# Altium schematic sheet Option_Audio.SchDoc
size 297 x 209 mm
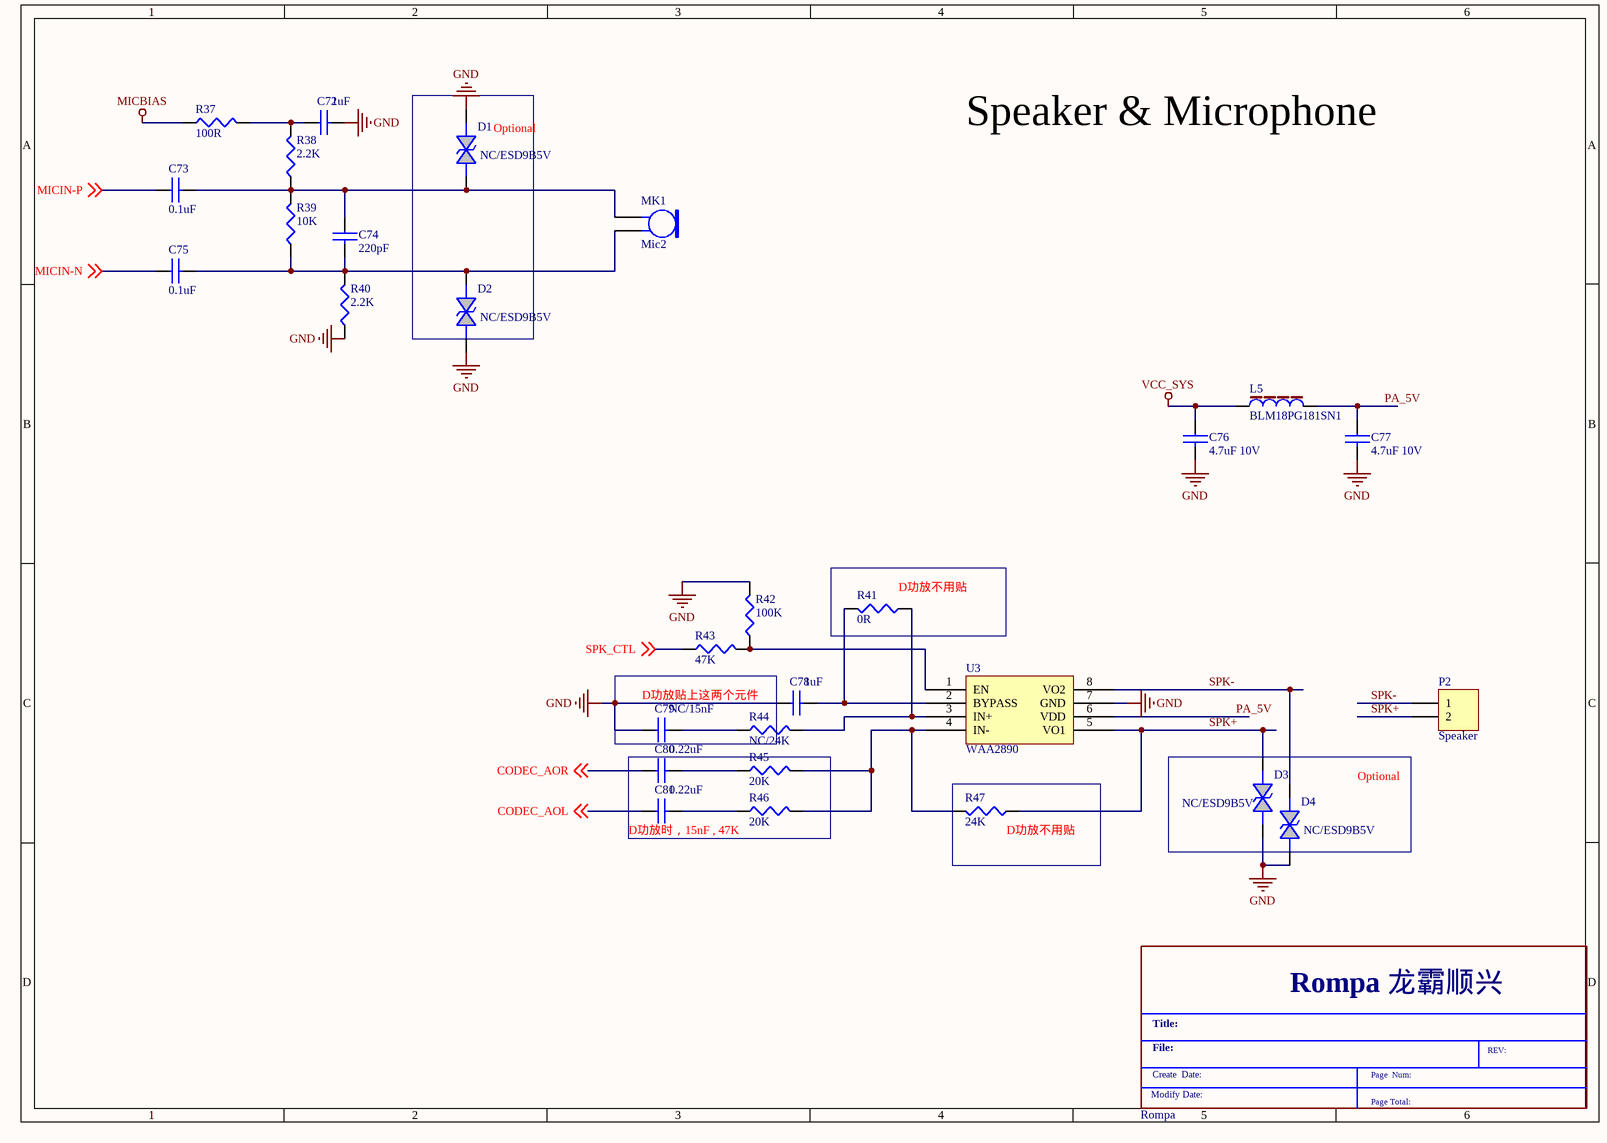
[diagram p0: Option_Audio.SchDoc]

## Parts
*  Rompa  (graphical)
C72  1uF  [C0402]
C73  0.1uF  [C0402]
C74  220pF  [C0402]
C75  0.1uF  [C0402]
C76  4.7uF 10V  [C0603]
C77  4.7uF 10V  [C0603]
C78  1uF  [C0402]
C79  NC/15nF  [C0402]
C80  0.22uF  [C0805]
C81  0.22uF  [C0805]
D1  NC/ESD9B5V
D2  NC/ESD9B5V
D3  NC/ESD9B5V
D4  NC/ESD9B5V
L5  BLM18PG181SN1  [L0603]
MK1  Mic2  [PIN2]
P2  Speaker  [HDR1X2]
R37  100R  [R0402]
R38  2.2K  [R0402]
R39  10K  [R0402]
R40  2.2K  [R0402]
R41  0R  [R0402]
R42  100K  [R0402]
R43  47K  [R0402]
R44  NC/24K  [R0402]
R45  20K  [1608[0603]]
R46  20K  [1608[0603]]
R47  24K  [R0402]
U3  WAA2890

## Blocks framed on the sheet
Optional: D1 D2
D功放不用贴: R41
D功放贴上这两个元件: C79 R44
D功放时，15nF , 47K: C80 C81 R45 R46
Optional: D3 D4
D功放不用贴: R47

## Nets
GND: C72.2 C76.2 C77.2 C78.1 C79.1 D1.2 D2.1 D3.1 D4.1 R40.1 R42.2 U3.7(GND)
MICBIAS: R37.1
VCC_SYS: C76.1 L5.1
CODEC_AOL: C81.1 ; off-sheet CODEC_AOL
CODEC_AOR: C80.1 ; off-sheet CODEC_AOR
MICIN-N: C75.1 ; off-sheet MICIN-N
MICIN-P: C73.1 ; off-sheet MICIN-P
PA_5V: C77.1 L5.2 U3.6(VDD)
SPK+: D3.2 P2.2 R47.1 U3.5(VO1)
SPK-: D4.2 P2.1 U3.8(VO2)
SPK_CTL: R43.1 ; off-sheet SPK_CTL
NetC72_1: C72.1 R37.2 R38.2
NetC73_2: C73.2 C74.1 D1.1 MK1.1 R38.1 R39.2
NetC74_2: C74.2 C75.2 D2.2 MK1.2 R39.1 R40.2
NetC78_2: C78.2 R41.2 U3.2(BYPASS)
NetC79_2: C79.2 R44.1
NetC80_2: C80.2 R45.1
NetC81_2: C81.2 R46.1
NetR41_1: R41.1 R44.2 U3.3(IN+)
NetR42_1: R42.1 R43.2 U3.1(EN)
NetR45_2: R45.2 R46.2 R47.2 U3.4(IN-)

## Notes on the sheet
- Speaker & Microphone
- (in symbol Rompa) Rompa 龙霸顺兴; Title:; File:; REV:; Create  Date:; Page  Num:; Modify Date:; Page Total:

## Library data of the parts
C72-C75 C78 = CAP NP
C76 C77 = CAP NP_Dup1
C79 = CAP NP: %10 10V
C80 C81 = CAP NP: 10V %10
D1-D4 = DIODE BI-DIR TRIG: FP:E0402N
L5 = INDUCTOR_2
MK1 = Mic2: Microphone; Published: 24-Mar-1999; LatestRevisionDate: 17-Jul-2002; LatestRevisionNote: Re-released for DXP Platform.; PackageReference: PIN2; Publisher: Altium Limited
P2 = Header 2: Header, 2-Pin; LatestRevisionDate: 17-Jul-2002; LatestRevisionNote: Re-released for DXP Platform.; Publisher: Altium Limited
R37-R43 R47 = RESISTOR
R44-R46 = RESISTOR: 1/16W %5
U3 = WAA2890: MSOP8